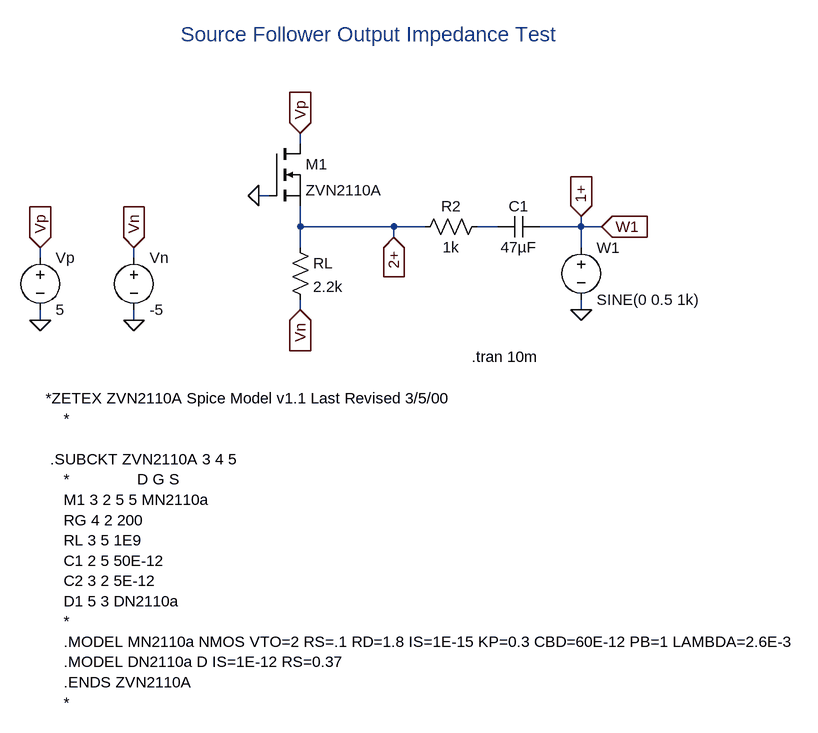
[diagram p0: schematic out_imp_mos.asc]
out_imp_mos.asc, the LTspice schematic file:
Version 4
SHEET 1 968 940
WIRE 144 112 144 96
WIRE 96 192 80 192
WIRE 144 240 144 208
WIRE 288 240 144 240
WIRE 336 240 288 240
WIRE 448 240 416 240
WIRE 576 240 576 224
WIRE 576 240 512 240
WIRE 608 240 576 240
WIRE 288 256 288 240
WIRE 144 272 144 240
WIRE 576 272 576 240
WIRE -256 288 -256 272
WIRE -112 288 -112 272
WIRE 144 368 144 352
WIRE 576 368 576 352
WIRE -256 384 -256 368
WIRE -112 384 -112 368
FLAG 80 192 0
FLAG 608 240 W1
IOPIN 608 240 In
FLAG 576 224 1+
IOPIN 576 224 In
FLAG 144 96 Vp
IOPIN 144 96 In
FLAG 144 368 Vn
IOPIN 144 368 In
FLAG 288 256 2+
IOPIN 288 256 In
FLAG 576 368 0
FLAG -256 384 0
FLAG -112 384 0
FLAG -256 272 Vp
IOPIN -256 272 In
FLAG -112 272 Vn
IOPIN -112 272 In
SYMBOL nmos 96 112 R0
SYMATTR InstName M1
SYMATTR Value ZVN2110A
SYMATTR Prefix X
SYMBOL res 128 256 R0
SYMATTR InstName RL
SYMATTR Value 2.2k
SYMBOL res 432 224 R90
WINDOW 0 0 56 VBottom 2
WINDOW 3 32 56 VTop 2
SYMATTR InstName R2
SYMATTR Value 1k
SYMBOL voltage 576 256 R0
WINDOW 123 0 0 Left 0
WINDOW 39 0 0 Left 0
SYMATTR InstName W1
SYMATTR Value SINE(0 0.5 1k)
SYMBOL voltage -112 272 R0
WINDOW 123 0 0 Left 0
WINDOW 39 0 0 Left 0
SYMATTR InstName Vn
SYMATTR Value -5
SYMBOL voltage -256 272 R0
WINDOW 123 0 0 Left 0
WINDOW 39 0 0 Left 0
SYMATTR InstName Vp
SYMATTR Value 5
SYMBOL cap 512 224 R90
WINDOW 0 0 32 VBottom 2
WINDOW 3 32 32 VTop 2
SYMATTR InstName C1
SYMATTR Value 47µF
TEXT -40 -56 Left 3 ;Source Follower Output Impedance Test
TEXT -248 504 Left 2 !*ZETEX ZVN2110A Spice Model v1.1 Last Revised 3/5/00\n    *\n   \n .SUBCKT ZVN2110A 3 4 5\n    *               D G S\n    M1 3 2 5 5 MN2110a\n    RG 4 2 200\n    RL 3 5 1E9\n    C1 2 5 50E-12\n    C2 3 2 5E-12\n    D1 5 3 DN2110a\n    *\n    .MODEL MN2110a NMOS VTO=2 RS=.1 RD=1.8 IS=1E-15 KP=0.3 CBD=60E-12 PB=1 LAMBDA=2.6E-3\n    .MODEL DN2110a D IS=1E-12 RS=0.37\n    .ENDS ZVN2110A\n    *
TEXT 408 440 Left 2 !.tran 10m

The netlist it stands for:
* out_imp_mos.asc
XM1 Vp 0 2+ ZVN2110A  ; pins D G S
RL 2+ Vn 2.2k
R2 N001 2+ 1k
V§W1 1+ 0 SINE(0 0.5 1k)
Vn Vn 0 -5
Vp Vp 0 5
C1 1+ N001 47µF
* Source Follower Output Impedance Test
*ZETEX ZVN2110A Spice Model v1.1 Last Revised 3/5/00
    *
 .SUBCKT ZVN2110A 3 4 5
    *               D G S
    M1 3 2 5 5 MN2110a
    RG 4 2 200
    RL 3 5 1E9
    C1 2 5 50E-12
    C2 3 2 5E-12
    D1 5 3 DN2110a
    *
    .MODEL MN2110a NMOS VTO=2 RS=.1 RD=1.8 IS=1E-15 KP=0.3 CBD=60E-12 PB=1 LAMBDA=2.6E-3
    .MODEL DN2110a D IS=1E-12 RS=0.37
    .ENDS ZVN2110A
    *
.tran 10m
.backanno
.end